# Altium schematic sheet SensorBoard.SchDoc
size A4; SheetNumber: 1; SheetTotal: 1
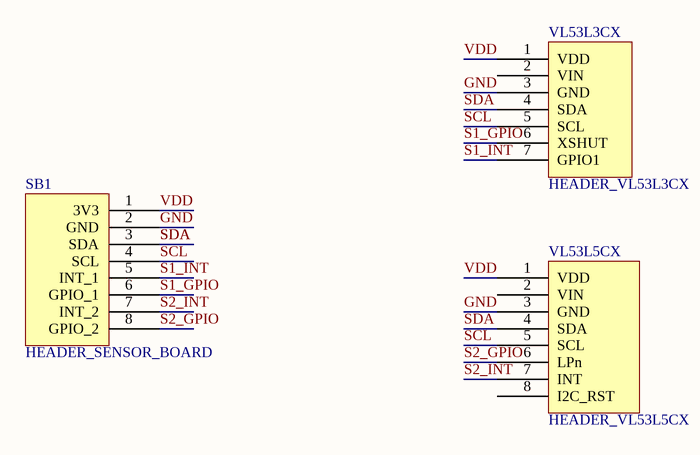
[diagram p0: SensorBoard.SchDoc]

## Parts
SB1  HEADER_SENSOR_BOARD  [HEADER_SENSOR_BOARD]
VL53L3CX  HEADER_VL53L3CX  [HEADER_VL53L3CX]
VL53L5CX  HEADER_VL53L5CX  [HEADER_VL53L5CX]

## Nets
GND: SB1.2(GND) VL53L3CX.3(GND) VL53L5CX.3(GND)
S1_GPIO: SB1.6(GPIO_1) VL53L3CX.6(XSHUT)
S1_INT: SB1.5(INT_1) VL53L3CX.7(GPIO1)
S2_GPIO: SB1.8(GPIO_2) VL53L5CX.6(LPn)
S2_INT: SB1.7(INT_2) VL53L5CX.7(INT)
SCL: SB1.4(SCL) VL53L3CX.5(SCL) VL53L5CX.5(SCL)
SDA: SB1.3(SDA) VL53L3CX.4(SDA) VL53L5CX.4(SDA)
VDD: SB1.1(3V3) VL53L3CX.1(VDD) VL53L5CX.1(VDD)

Not connected (* = marked no-connect by the designer): VL53L3CX 2(VIN); VL53L5CX 2(VIN) 8(I2C_RST)

## Library data of the parts
SB1 = HEADER_SENSOR_BOARD: Sensor Board header
VL53L3CX = HEADER_VL53L3CX: VL53L3CX Time-of-Flight Multi-Target Distance Sensor Carrier with Voltage Regulator, 500cm Max
VL53L5CX = HEADER_VL53L5CX: VL53L5CX Time-of-Flight 8×8-Zone Distance Sensor Carrier with Voltage Regulator, 400cm Max